# Altium schematic sheet Part10_SD_card.SchDoc
size A4
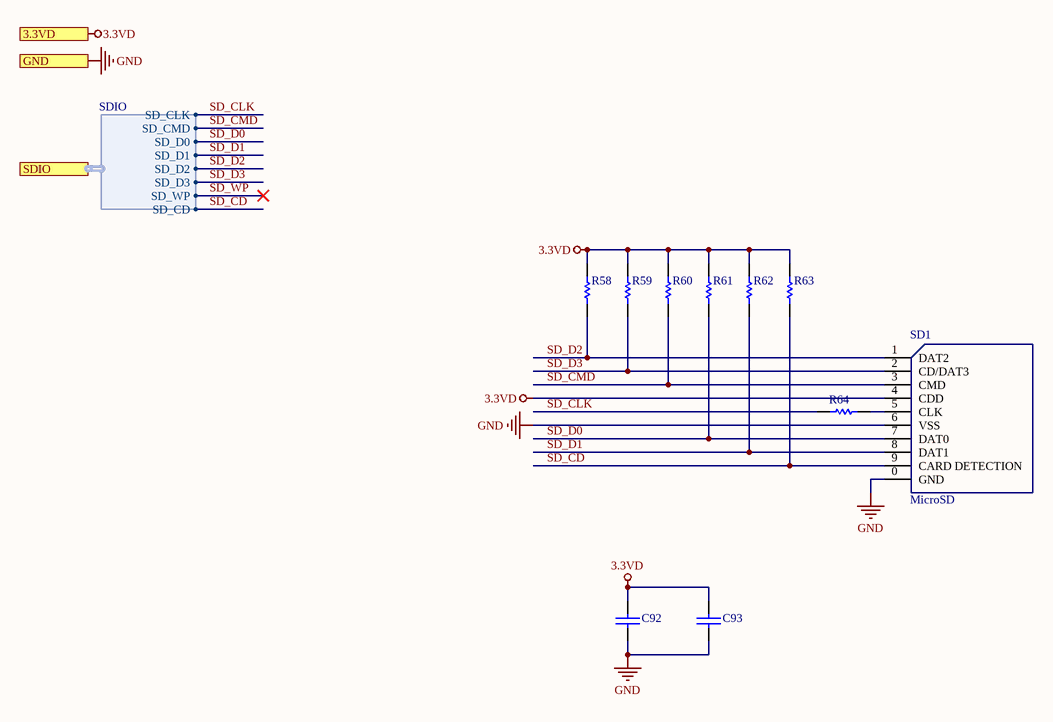
[diagram p0: Part10_SD_card.SchDoc]

## Parts
C92  10uF  [0402C]  (value not drawn)
C93  100nF  [0402C]  (value not drawn)
R58  10K  [0402R]  (value not drawn)
R59  10K  [0402R]  (value not drawn)
R60  10K  [0402R]  (value not drawn)
R61  10K  [0402R]  (value not drawn)
R62  10K  [0402R]  (value not drawn)
R63  10K  [0402R]  (value not drawn)
R64  22R  [0402R]  (value not drawn)
SD1  MicroSD  [Micro SD]

## Ports
3.3VD, GND, SDIO (harness SDIO)

## Harnesses
SDIO: SD_CLK, SD_CMD, SD_D0, SD_D1, SD_D2, SD_D3, SD_WP, SD_CD

## Nets
3.3VD: C92.1 C93.1 R58.1 R59.1 R60.1 R61.1 R62.1 R63.1 SD1.4(CDD) ; port 3.3VD
GND: C92.2 C93.2 SD1.0(GND) SD1.6(VSS) ; port GND
SD_CD: R63.2 SD1.9(CARD_DETECTION) ; port SDIO.SD_CD
SD_CLK: R64.1 ; port SDIO.SD_CLK
SD_CMD: R60.2 SD1.3(CMD) ; port SDIO.SD_CMD
SD_D0: R61.2 SD1.7(DAT0) ; port SDIO.SD_D0
SD_D1: R62.2 SD1.8(DAT1) ; port SDIO.SD_D1
SD_D2: R58.2 SD1.1(DAT2) ; port SDIO.SD_D2
SD_D3: R59.2 SD1.2(CD/DAT3) ; port SDIO.SD_D3
SD_WP: port SDIO.SD_WP
NetR64_2: R64.2 SD1.5(CLK)

## Library data of the parts
C92 C93 = CAP: 无极性电容
R58-R64 = RES